# Altium schematic sheet button.schdoc
size 51 x 27 mm
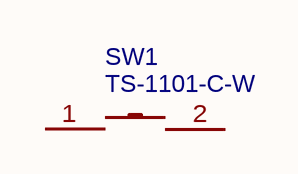
[diagram p0: button.schdoc]

## Parts
SW1  TS-1101-C-W  [SW-SMD_L6.0-W3.3-LS8.0]

## Nets

Not connected (* = marked no-connect by the designer): SW1 1 2

## Library data of the parts
SW1 = TS-1101-C-W: BOM_Manufacturer: XKB Connectivity(中国星坤); Contributor: LCSC; BOM_Supplier: LCSC; BOM_Supplier Part: C318938; BOM_Manufacturer Part: TS-1101-C-W; BOM_JLCPCB Part Class: Extended Part; spicePre: S; spiceSymbolName: TS-1101-C-W